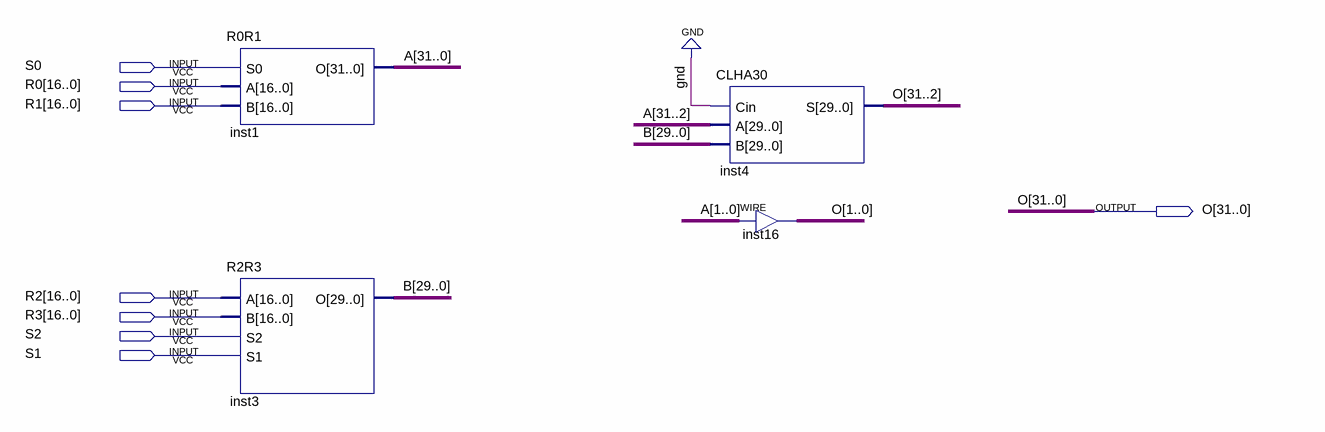
[diagram p0: schematic sheet]
// Quartus schematic R0123.bdf as structural Verilog: 4 symbols, 8 pins
module R0123 (
  input  S0,
  input  [16:0] R0,
  input  [16:0] R1,
  input  [16:0] R2,
  input  [16:0] R3,
  input  S2,
  input  S1,
  output [31:0] O
);

  wire [29:0] B;
  wire [31:0] A;

  R0R1 inst1 (.S0(S0), .A(R0), .B(R1), .O(A));
  R2R3 inst3 (.A(R2), .B(R3), .S2(S2), .S1(S1), .O(B));
  CLHA30 inst4 (.Cin(1'b0), .A(A[31:2]), .B(B), .S(O[31:2]));
  assign O[1:0] = A[1:0];  // WIRE inst16
endmodule
